# EAGLE design ProtoPow (EAGLE 5.11)
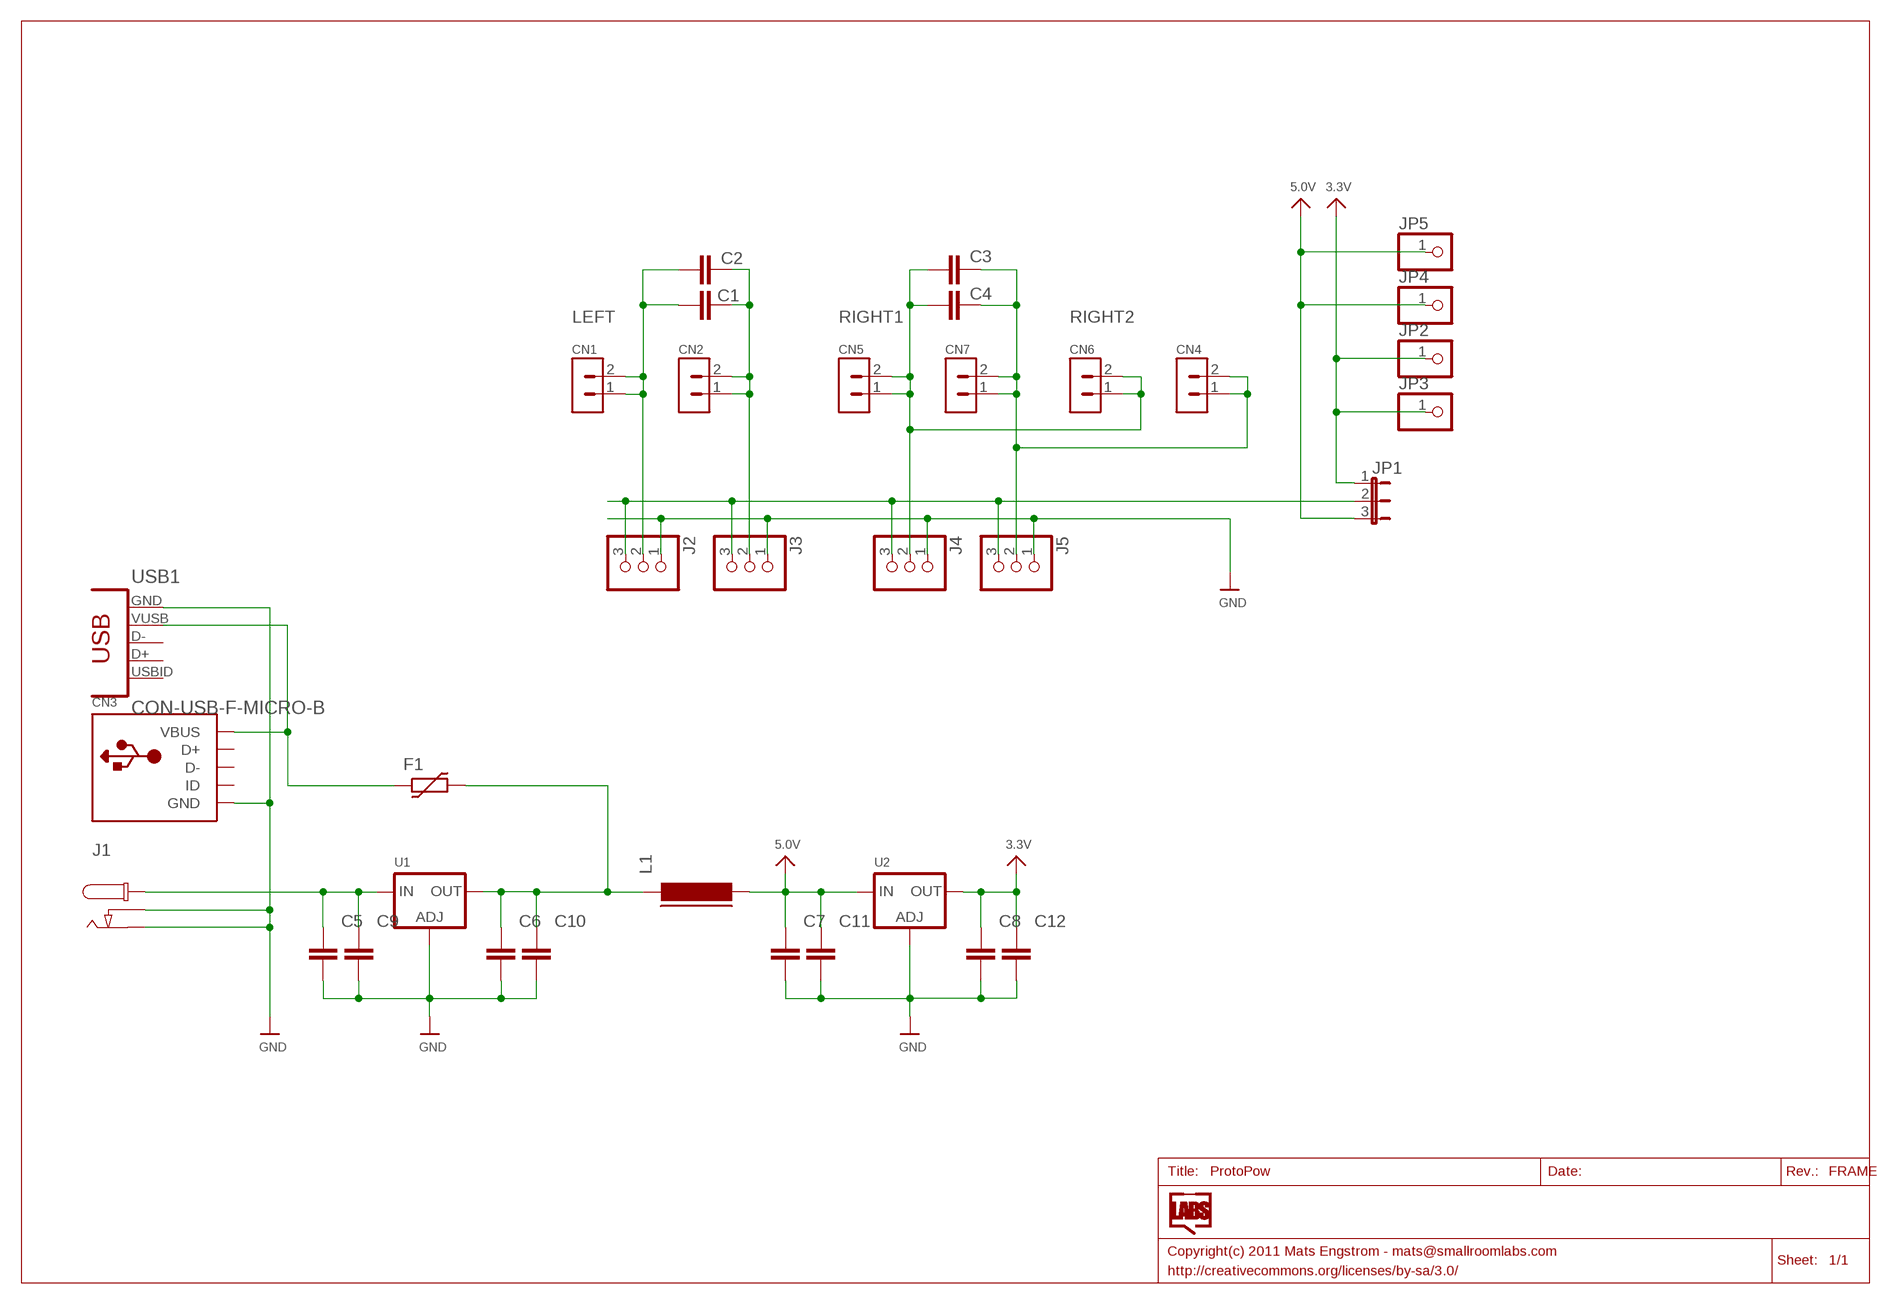
[diagram p0: schematic, sheet 1]

## Parts
C1  CAPACITOR_NPOL-0805  [C805]
C2  CAPACITOR_NPOL-1206  [C1206]
C3  CAPACITOR_NPOL-1206  [C1206]
C4  CAPACITOR_NPOL-0805  [C805]
C5  CAPACITOR_NPOL-0805  [C805]
C6  CAPACITOR_NPOL-0805  [C805]
C7  CAPACITOR_NPOL-0805  [C805]
C8  CAPACITOR_NPOL-0805  [C805]
C9  CAPACITOR_NPOL-1206  [C1206]
C10  CAPACITOR_NPOL-1206  [C1206]
C11  CAPACITOR_NPOL-1206  [C1206]
C12  CAPACITOR_NPOL-1206  [C1206]
CN1  HEADER_1X02  [HEADER_1X02]
CN2  HEADER_1X02  [HEADER_1X02]
CN3  USBMINIB  [USB-MINIB]
CN4  HEADER_1X02  [HEADER_1X02]
CN5  HEADER_1X02  [HEADER_1X02]
CN6  HEADER_1X02  [HEADER_1X02]
CN7  HEADER_1X02  [HEADER_1X02]
F1  FUSE_PTC-1812  [PTC1812L]
J1  CON_DC_M-DC_SMD  [DC_BARREL_JACK_SMD_2MM]
J2  JUMPER_1X3ALT  [JUMPER_SOLDER]
J3  JUMPER_1X3ALT  [JUMPER_SOLDER]
J4  JUMPER_1X3ALT  [JUMPER_SOLDER]
J5  JUMPER_1X3ALT  [JUMPER_SOLDER]
JP1  JP2E  [JP2]
JP2  HEADER-1X1ROUND  [1X01_ROUND]
JP3  HEADER-1X1ROUND  [1X01_ROUND]
JP4  HEADER-1X1ROUND  [1X01_ROUND]
JP5  HEADER-1X1ROUND  [1X01_ROUND]
L1  FERRITE-0805  [FB805]
U1  LM1117SOT223-WAVE  [SOT223-W]
U2  LM1117SOT223-WAVE  [SOT223-W]
USB1  CON-USB-F-MICRO-B  [CONN_USB_MICRO-B]

## Nets
3.3V: C8.1 C12.1 JP1.1 JP2.1 JP3.1 U2.2(OUT)
5.0V: C7.1 C11.1 JP1.3 JP4.1 JP5.1 L1.2 U2.3(IN)
DC: C5.1 C9.1 J1.P1@2(P1) U1.3(IN)
GND: C5.2 C6.2 C7.2 C8.2 C9.2 C10.2 C11.2 C12.2 CN3.GND J1.P2 J1.P3 J2.1 J3.1 J4.1 J5.1 U1.1(ADJ) U2.1(ADJ) USB1.P5(GND)
LEFT-POW: J2.3 J3.3 J4.3 J5.3 JP1.2
LEFT-RAIL-A: C1.1 C2.1 CN1.1 CN1.2 J2.2
LEFT-RAIL-B: C1.2 C2.2 CN2.1 CN2.2 J3.2
ME: C3.2 C4.2 CN4.1 CN4.2 CN7.1 CN7.2 J5.2
N$1: C6.1 C10.1 F1.2 L1.1 U1.2(OUT)
N$3: C3.1 C4.1 CN5.1 CN5.2 CN6.1 CN6.2 J4.2
VUSB: CN3.VBUS F1.1 USB1.P1(VUSB)
Unconnected: CN3.D+ CN3.D- CN3.ID USB1.BODY@1(BODY) USB1.BODY@2(BODY) USB1.BODY@3(BODY) USB1.BODY@4(BODY) USB1.P2(D-) USB1.P3(D+) USB1.P4(USBID)

## Notes on the sheet
- LEFT | RIGHT1 | RIGHT2

## Library data of the parts
C1-C12 = dp_devices:CAPACITOR_NPOL: Non-Polarized capacitor in various packages
CN1 CN2 CN4-CN7 = microbuilder:HEADER_1X02: 2-Pin 0,254cm / 0.1" Header
CN3 = adafruit:USB: USB Connectors USBMINIB - Surface Mount Female Mini-B USB Connector 4UConnector: 06564 By microbuilder.eu Thru-hole RA Female Mini-B USB Connector 4UConnector: 18732 By ladyada.net
F1 = dp_devices:FUSE_PTC: Resettable PTC
J1 = dp_devices:CON_DC_M: DC power connector
J2-J5 = dp_devices:JUMPER_1X3
JP1 = jumper:JP2E: JUMPER
JP2-JP5 = microbuilder:HEADER-1X1: PIN HEADER
L1 = dp_devices:FERRITE: Ferrite bead in various packages
U1 U2 = microbuilder:LM1117: LM1117 Voltage Regulator LM1117 Adjustable Voltage regulator [Digikey: LM1117IMP-ADJDKR-ND] LM1117 3.3V Voltage regulator [AP1117E33GDIDKR-ND] LM1117 5.0V Voltage regulator [AP1117E50GDIDKR-ND] SOT223-REFLOW - SOT223 package for solder paste/reflow ovens SOT223-WAVE - SOT223 package for hand-soldering (larger pads) Note: For the fixed-voltage regulators, simply set the ADJ pin to GND.
USB1 = dp_devices:CON-USB-F: USB Female connector

## Board
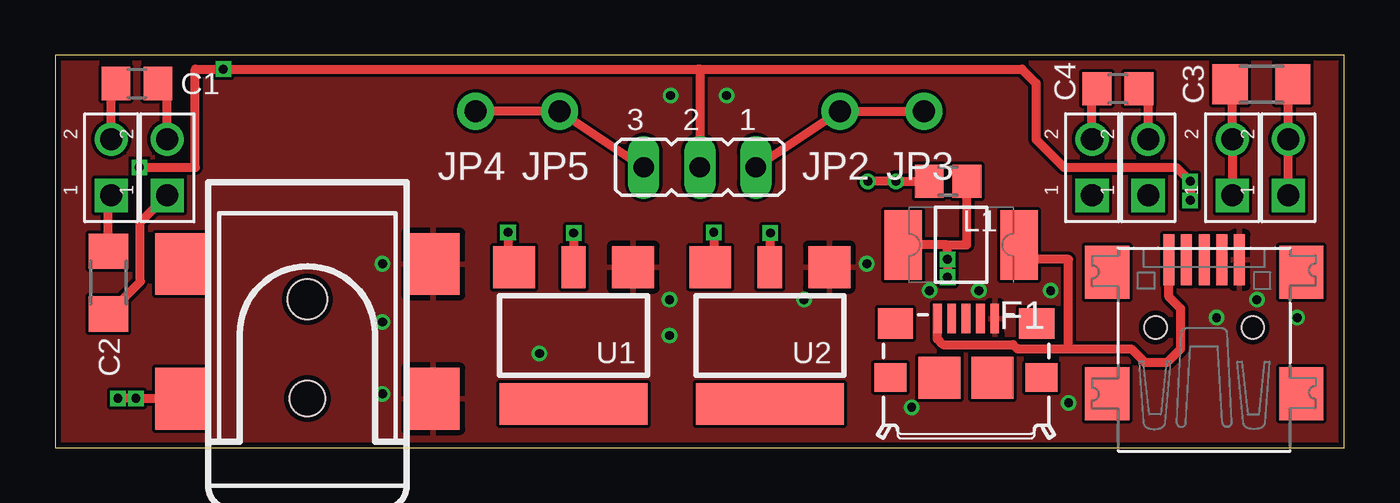
[diagram p1: board, top side]
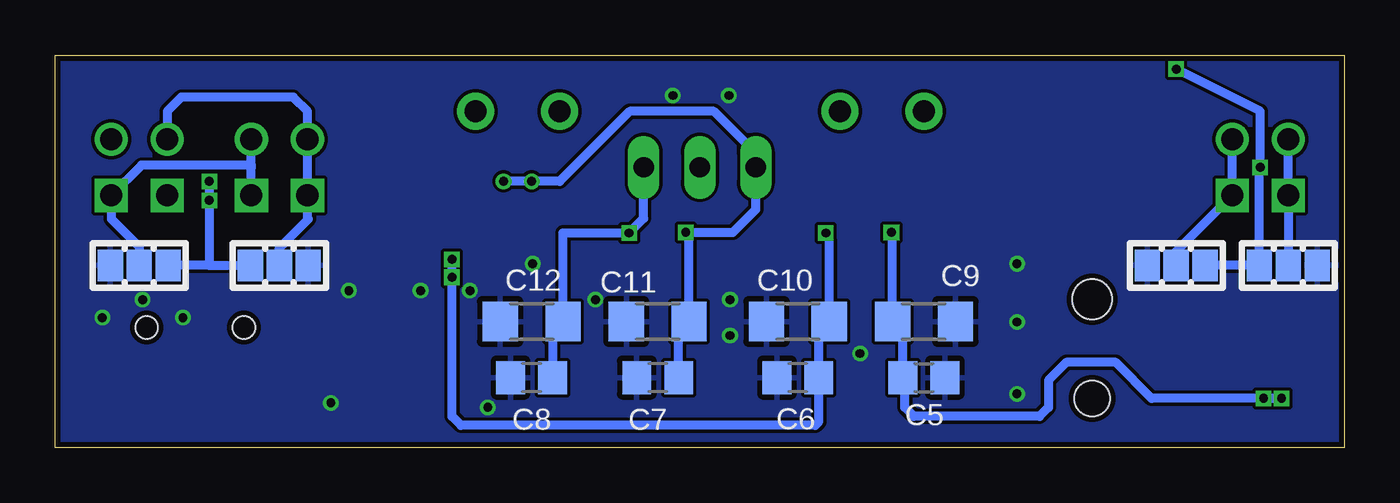
[diagram p2: board, bottom side, seen from below]

Size 58.42 x 17.78 mm. Coordinates in mm from the lower left corner, seen from the top.
Outline: 0,0 58.42,0 58.42,17.78 0,17.78 0,0
Copper layers (1*16): Top 0.035mm / dielectric 1.5mm / Bottom 0.035mm
Design rules "Fusion_eagle_rule_v1.1": minimum track width 6mil, minimum drill 12mil, track to track 6mil, track to pad 6mil, pad to pad 6mil, via to via 6mil, smd to smd 0mil, copper to edge 10mil, drill to drill 10mil, minimum pad ring 10mil, minimum via ring 6mil, stop-mask expansion 2mil, vias tented up to drill 100mil, thermal gap 10mil

### Footprints (pad centres in the part's own frame; a part is rotated, then mirrored left to right if it is on the bottom)
C805 = smd 1.3 x 1.5: 1 -0.95,0; 2 0.95,0
C1206 = smd 1.6 x 1.803: 1 -1.422,0; 2 1.422,0
HEADER_1X02 = drill 1 square: 1 0,0 | drill 1 round: 2 2.54,0
USB-MINIB = smd 0.5 x 2.308: D+ 0,4.064; D- -0.8,4.064; GND 1.6,4.064; ID 0.8,4.064; VBUS -1.6,4.064 | smd 2 x 2.4: GND1 -4.4,-2; GND2 -4.4,3.5; GND3 4.4,3.5; GND4 4.4,-2 | hole 1: -2.2,1; 2.2,1
PTC1812L = smd 1.7 x 3.15: 1 -2.62,0; 2 2.62,0
DC_BARREL_JACK_SMD_2MM = smd 2.4 x 2.8: P1@1 -5.7,3.875; P1@2 -5.7,-2.225; P2 5.7,-2.225; P3 5.7,3.875 | hole 1.8: 0,2.275 | hole 1.6: 0,-2.225
JUMPER_SOLDER = smd 1.143 x 1.422: 1 -1.308,0; 2 0,0; 3 1.308,0
JP2 = drill 0.914 long: 1 -2.54,0; 2 0,0; 3 2.54,0
1X01_ROUND = drill 1 pad 1.676 round: 1 0,0
FB805 = smd 1.3 x 1.5: 1 -0.85,0; 2 0.85,0
SOT223-W = smd 1.9 x 1.9: 1 -2.7,-3.1; 3 2.7,-3.1 | smd 1.1 x 1.9: 2 0,-3.1 | smd 6.7 x 1.9: 4 0,3.1
CONN_USB_MICRO-B = smd 1.6 x 1.4: BODY@1 -3.2,2.45; BODY@2 3.2,2.45 | smd 1.45 x 1.3: BODY@3 3.425,0; BODY@6 -3.425,0 | smd 1.9 x 1.9: BODY@4 1.2,0; BODY@5 -1.2,0 | smd 0.4 x 1.35: P1 -1.3,2.675; P2 -0.65,2.675; P3 0,2.675; P4 0.65,2.675; P5 1.3,2.675

### Placement (x,y rotation side)
C1  3.7,16.5 0 top
C2  2.41,7.47 270 top
C3  54.66,16.46 180 top
C4  48.16,16.26 180 top
C5  19.05,3.17 0 bottom
C6  24.77,3.17 180 bottom
C7  31.11,3.17 180 bottom
C8  36.83,3.17 180 bottom
C9  19.05,5.71 0 bottom
C10  24.77,5.71 180 bottom
C11  31.11,5.71 180 bottom
C12  36.83,5.71 180 bottom
CN1  2.54,11.43 90 top
CN2  5.08,11.43 90 top
CN3  52.07,4.45 0 top
CN4  53.34,11.43 90 top
CN5  49.53,11.43 90 top
CN6  55.88,11.43 90 top
CN7  46.99,11.43 90 top
F1  41.05,9.19 180 top
J1  11.43,4.45 0 top
J2  2.54,8.26 180 bottom
J3  7.62,8.26 0 bottom
J4  54.61,8.26 0 bottom
J5  48.26,8.26 180 bottom
JP1  29.21,12.7 180 top
JP2  35.56,15.24 180 top
JP3  39.37,15.24 180 top
JP4  19.05,15.24 180 top
JP5  22.86,15.24 180 top
L1  40.46,12.06 180 top
U1  23.5,5.08 180 top
U2  32.38,5.08 180 top
USB1  41.27,3.17 0 top

### Tracks (layer width: path | path; a pad name or v marks a point on that pad's centre or on a via)
3.3V  (via drill 0.4)
  Top 0.406: v32.41,9.73 32.38,9.53 U2.2 | JP1.1 JP2.1 JP3.1
  Bottom 0.406: C8.1 35.88,5.71 C12.1 35.41,9.73 v32.41,9.73 31.75,10.39 JP1.1
5.0V  (via drill 0.4)
  Top 0.406: v29.84,9.75 29.84,8.18 U2.3 | JP1.3 JP5.1 JP4.1 | L1.2 v38.1,12.06 v36.83,12.06
  Bottom 0.406: C7.1 30.16,5.71 C11.1 29.69,9.75 | 29.69,9.75 v29.84,9.75 | 29.69,9.75 27.71,9.75 26.67,10.79 JP1.3 26.67,13.34 28.57,15.24 32.38,15.24 35.56,12.06 v38.1,12.06
DC  (via drill 0.4)
  Top 0.406: v20.52,9.75 20.52,8.18 U1.3 | J1.P1@2 4.67,2.22 4.67,2.23 v3.66,2.23 | v3.66,2.23 v2.85,2.23 | v3.66,2.23 4.06,2.23
  Bottom 0.406: v20.52,9.75 20.47,9.75 C9.1 20,5.24 C5.1 19.91,3.09 19.91,1.83 19.51,1.42 13.82,1.42 13.41,1.83 13.41,3.05 12.6,3.86 10.36,3.86 8.74,2.23 v2.85,2.23 v3.66,2.23
GND  (via drill 0.4)
  other vias: 14.83,5.69 14.83,8.33 14.83,2.44 27.84,6.71 33.93,6.71 54.46,6.71 56.29,5.89 52.63,5.89 27.84,5.08 36.78,8.33 41.86,7.11 45.11,7.11 45.92,2.03 27.89,15.95 30.43,15.95 39.62,7.11 38.81,1.83 21.95,4.27
  pour Top: 0,0 0,17.78 58.42,17.78 58.42,0
  pour Bottom: 0,0 0,17.78 58.42,17.78 58.42,0
LEFT-POW  (via drill 0.4)
  Top 0.406: v3.81,12.7 6.35,12.7 6.35,17.14 29.13,17.14 29.21,17.07 | 29.21,17.07 JP1.2 | 29.21,17.07 29.21,17.14 43.81,17.14 44.45,16.51 44.45,13.97 45.72,12.7 50.8,12.7 v51.44,12.06 v51.44,11.2
  Bottom 0.406: 51.44,8.26 J4.3 | J3.3 J2.3 3.85,12.7 v3.81,12.7 3.81,15.24 v7.62,17.14 | v51.44,12.06 51.44,8.26 | 51.44,8.26 J5.3
LEFT-RAIL-A
  Top 0.406: C2.1 2.41,11.3 CN1.1 | CN1.2 2.54,16.28 C1.1
  Bottom 0.406: CN1.2 CN1.1 J2.2
LEFT-RAIL-B
  Top 0.406: C2.2 2.41,6.07 3.86,7.52 3.86,10.21 CN2.1 | CN2.2 5.08,16.07 C1.2
  Bottom 0.406: CN2.2 CN2.1 7.62,8.89 J3.2
ME
  Top 0.406: CN4.1 CN4.2 53.34,16.36 C3.2 | CN7.2 46.99,16.04 C4.2
  Bottom 0.406: J5.2 48.26,9.04 46.94,10.36 46.99,10.41 CN7.1 CN7.2 46.99,15.24 47.62,15.88 52.7,15.88 53.34,15.24 CN4.2
N$1  (via drill 0.4)
  Top 0.406: 40.44,9.19 F1.2 | 40.44,9.19 41.31,9.19 L1.1 | v23.5,9.73 U1.2 | v40.44,7.72 v40.44,8.53 40.44,9.19
  Bottom 0.406: v23.5,9.73 23.34,9.37 C10.1 23.82,5.24 C6.1 23.82,1.18 23.98,1.02 40.03,1.02 40.44,1.42 v40.44,8.53
N$3
  Top 0.406: CN6.1 CN6.2 55.88,16.26 C3.1 | CN5.2 49.53,15.83 C4.1
  Bottom 0.406: CN5.1 49.53,12.7 49.53,12.8 | 49.53,12.8 CN5.2 | J4.2 54.61,9.09 55.88,10.36 CN6.1 54.51,12.8 49.53,12.8
VUSB
  Top 0.406: F1.1 43.67,8.53 45.92,8.53 45.92,4.47 | 45.92,4.47 48.77,4.47 49.38,3.86 50.39,3.86 51,4.47 51,6.3 50.47,6.83 CN3.VBUS | USB1.P1 39.98,4.93 40.23,4.67 43.41,4.67 43.61,4.47 45.92,4.47